# Altium schematic sheet MPBoard_L2_Relay1_ext.SchDoc
size A3; SheetNumber: 2; SheetTotal: 5
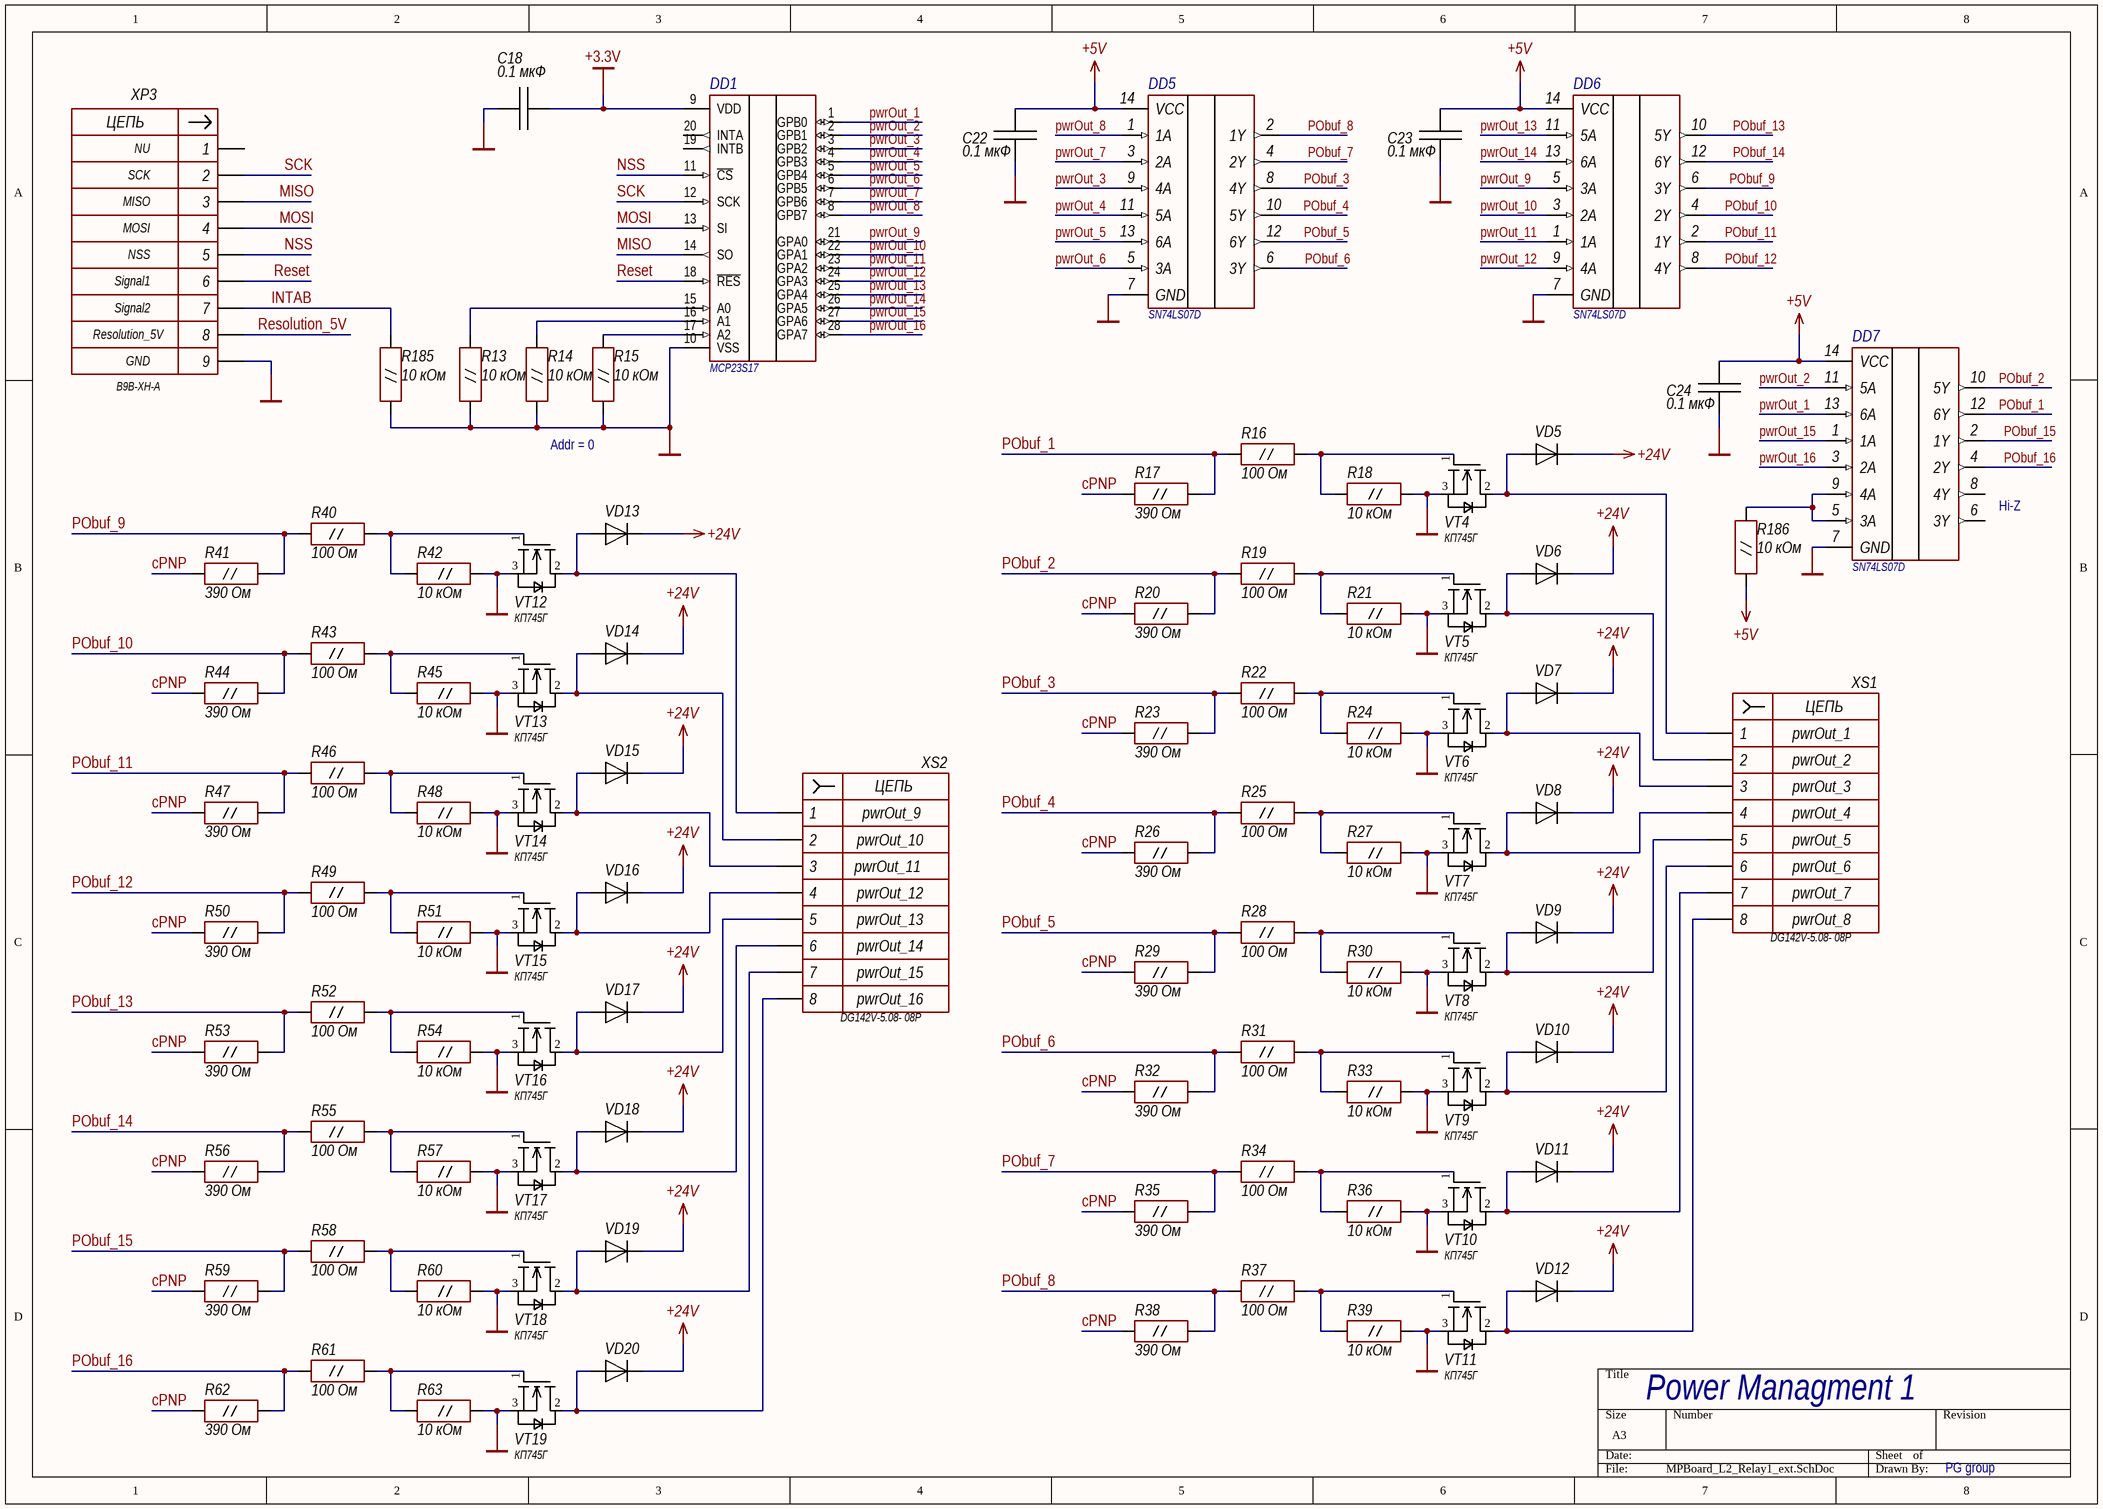
[diagram p0: MPBoard_L2_Relay1_ext.SchDoc]

## Parts
C18  0.1 мкФ  [CAP-0603]
C22  0.1 мкФ  [CAP-0603]
C23  0.1 мкФ  [CAP-0603]
C24  0.1 мкФ  [CAP-0603]
DD1  MCP23S17  [SOIC-28]
DD5  SN74LS07D  [SOIC-14]
DD6  SN74LS07D  [SOIC-14]
DD7  SN74LS07D  [SOIC-14]
R13  10 кОм  [RES-0603]
R14  10 кОм  [RES-0603]
R15  10 кОм  [RES-0603]
R16  100 Ом  [RES-0805]
R17  390 Ом  [RES-0805]
R18  10 кОм  [RES-0805]
R19  100 Ом  [RES-0805]
R20  390 Ом  [RES-0805]
R21  10 кОм  [RES-0805]
R22  100 Ом  [RES-0805]
R23  390 Ом  [RES-0805]
R24  10 кОм  [RES-0805]
R25  100 Ом  [RES-0805]
R26  390 Ом  [RES-0805]
R27  10 кОм  [RES-0805]
R28  100 Ом  [RES-0805]
R29  390 Ом  [RES-0805]
R30  10 кОм  [RES-0805]
R31  100 Ом  [RES-0805]
R32  390 Ом  [RES-0805]
R33  10 кОм  [RES-0805]
R34  100 Ом  [RES-0805]
R35  390 Ом  [RES-0805]
R36  10 кОм  [RES-0805]
R37  100 Ом  [RES-0805]
R38  390 Ом  [RES-0805]
R39  10 кОм  [RES-0805]
R40  100 Ом  [RES-0805]
R41  390 Ом  [RES-0805]
R42  10 кОм  [RES-0805]
R43  100 Ом  [RES-0805]
R44  390 Ом  [RES-0805]
R45  10 кОм  [RES-0805]
R46  100 Ом  [RES-0805]
R47  390 Ом  [RES-0805]
R48  10 кОм  [RES-0805]
R49  100 Ом  [RES-0805]
R50  390 Ом  [RES-0805]
R51  10 кОм  [RES-0805]
R52  100 Ом  [RES-0805]
R53  390 Ом  [RES-0805]
R54  10 кОм  [RES-0805]
R55  100 Ом  [RES-0805]
R56  390 Ом  [RES-0805]
R57  10 кОм  [RES-0805]
R58  100 Ом  [RES-0805]
R59  390 Ом  [RES-0805]
R60  10 кОм  [RES-0805]
R61  100 Ом  [RES-0805]
R62  390 Ом  [RES-0805]
R63  10 кОм  [RES-0805]
R185  10 кОм  [RES-0603]
R186  10 кОм  [RES-0603]
VD5  HER108  [DIOD-MILS-400]  (value not drawn)
VD6  HER108  [DIOD-MILS-400]  (value not drawn)
VD7  HER108  [DIOD-MILS-400]  (value not drawn)
VD8  HER108  [DIOD-MILS-400]  (value not drawn)
VD9  HER108  [DIOD-MILS-400]  (value not drawn)
VD10  HER108  [DIOD-MILS-400]  (value not drawn)
VD11  HER108  [DIOD-MILS-400]  (value not drawn)
VD12  HER108  [DIOD-MILS-400]  (value not drawn)
VD13  HER108  [DIOD-MILS-400]  (value not drawn)
VD14  HER108  [DIOD-MILS-400]  (value not drawn)
VD15  HER108  [DIOD-MILS-400]  (value not drawn)
VD16  HER108  [DIOD-MILS-400]  (value not drawn)
VD17  HER108  [DIOD-MILS-400]  (value not drawn)
VD18  HER108  [DIOD-MILS-400]  (value not drawn)
VD19  HER108  [DIOD-MILS-400]  (value not drawn)
VD20  HER108  [DIOD-MILS-400]  (value not drawn)
VT4  КП745Г  [TO220S inline]
VT5  КП745Г  [TO220S inline]
VT6  КП745Г  [TO220S inline]
VT7  КП745Г  [TO220S inline]
VT8  КП745Г  [TO220S inline]
VT9  КП745Г  [TO220S inline]
VT10  КП745Г  [TO220S inline]
VT11  КП745Г  [TO220S inline]
VT12  КП745Г  [TO220S inline]
VT13  КП745Г  [TO220S inline]
VT14  КП745Г  [TO220S inline]
VT15  КП745Г  [TO220S inline]
VT16  КП745Г  [TO220S inline]
VT17  КП745Г  [TO220S inline]
VT18  КП745Г  [TO220S inline]
VT19  КП745Г  [TO220S inline]
XP3  B9B-XH-A  NET9: GND  NET8: Resolution_5V  NET7: Signal2  NET6: Signal1  NET5: MOSI  NET1: NU  NET2: NSS  NET3: SCK  NET4: MISO  [JST-B9B-XH-A]
XS1  DG142V-5.08- 08P  NET6: pwrOut_6  NET5: pwrOut_5  NET1: pwrOut_1  NET2: pwrOut_2  NET3: pwrOut_3  NET4: pwrOut_4  NET7: pwrOut_7  NET8: pwrOut_8  [DG142V-5.08-08]
XS2  DG142V-5.08- 08P  NET6: pwrOut_14  NET5: pwrOut_13  NET1: pwrOut_9  NET2: pwrOut_10  NET3: pwrOut_11  NET4: pwrOut_12  NET7: pwrOut_15  NET8: pwrOut_16  [DG142V-5.08-08]

## Nets
+3.3V: C18.2 DD1.9(VDD)
+5V: C22.2 C23.2 C24.2 DD5.14(VCC) DD6.14(VCC) DD7.14(VCC) R186.1
+24V: VD5.2 VD6.2 VD7.2 VD8.2 VD9.2 VD10.2 VD11.2 VD12.2 VD13.2 VD14.2 VD15.2 VD16.2 VD17.2 VD18.2 VD19.2 VD20.2
GND: C18.1 C22.1 C23.1 C24.1 DD1.10(VSS) DD5.7(GND) DD6.7(GND) DD7.7(GND) R13.1 R14.1 R15.1 R18.1 R21.1 R24.1 R27.1 R30.1 R33.1 R36.1 R39.1 R42.1 R45.1 R48.1 R51.1 R54.1 R57.1 R60.1 R63.1 R185.1 VT4.3(S) VT5.3(S) VT6.3(S) VT7.3(S) VT8.3(S) VT9.3(S) VT10.3(S) VT11.3(S) VT12.3(S) VT13.3(S) VT14.3(S) VT15.3(S) VT16.3(S) VT17.3(S) VT18.3(S) VT19.3(S) XP3.9
cPNP: R17.1 R20.1 R23.1 R26.1 R29.1 R32.1 R35.1 R38.1 R41.1 R44.1 R47.1 R50.1 R53.1 R56.1 R59.1 R62.1
INTAB: R185.2 XP3.7
MISO: DD1.14(SO) XP3.3
MOSI: DD1.13(SI) XP3.4
NSS: DD1.11(~{CS}) XP3.5
PObuf_1: DD7.12(6Y) R16.1 R17.2
PObuf_2: DD7.10(5Y) R19.1 R20.2
PObuf_3: DD5.8(4Y) R22.1 R23.2
PObuf_4: DD5.10(5Y) R25.1 R26.2
PObuf_5: DD5.12(6Y) R28.1 R29.2
PObuf_6: DD5.6(3Y) R31.1 R32.2
PObuf_7: DD5.4(2Y) R34.1 R35.2
PObuf_8: DD5.2(1Y) R37.1 R38.2
PObuf_9: DD6.6(3Y) R40.1 R41.2
PObuf_10: DD6.4(2Y) R43.1 R44.2
PObuf_11: DD6.2(1Y) R46.1 R47.2
PObuf_12: DD6.8(4Y) R49.1 R50.2
PObuf_13: DD6.10(5Y) R52.1 R53.2
PObuf_14: DD6.12(6Y) R55.1 R56.2
PObuf_15: DD7.2(1Y) R58.1 R59.2
PObuf_16: DD7.4(2Y) R61.1 R62.2
pwrOut_1: DD1.1(GPB0) DD7.13(6A)
pwrOut_2: DD1.2(GPB1) DD7.11(5A)
pwrOut_3: DD1.3(GPB2) DD5.9(4A)
pwrOut_4: DD1.4(GPB3) DD5.11(5A)
pwrOut_5: DD1.5(GPB4) DD5.13(6A)
pwrOut_6: DD1.6(GPB5) DD5.5(3A)
pwrOut_7: DD1.7(GPB6) DD5.3(2A)
pwrOut_8: DD1.8(GPB7) DD5.1(1A)
pwrOut_9: DD1.21(GPA0) DD6.5(3A)
pwrOut_10: DD1.22(GPA1) DD6.3(2A)
pwrOut_11: DD1.23(GPA2) DD6.1(1A)
pwrOut_12: DD1.24(GPA3) DD6.9(4A)
pwrOut_13: DD1.25(GPA4) DD6.11(5A)
pwrOut_14: DD1.26(GPA5) DD6.13(6A)
pwrOut_15: DD1.27(GPA6) DD7.1(1A)
pwrOut_16: DD1.28(GPA7) DD7.3(2A)
Reset: DD1.18(~{RES}) XP3.6
Resolution_5V: XP3.8
SCK: DD1.12(SCK) XP3.2
NetDD1_15: DD1.15(A0) R13.2
NetDD1_16: DD1.16(A1) R14.2
NetDD1_17: DD1.17(A2) R15.2
NetDD7_5: DD7.5(3A) DD7.9(4A) R186.2
NetR16_2: R16.2 R18.2 VT4.1(G)
NetR19_2: R19.2 R21.2 VT5.1(G)
NetR22_2: R22.2 R24.2 VT6.1(G)
NetR25_2: R25.2 R27.2 VT7.1(G)
NetR28_2: R28.2 R30.2 VT8.1(G)
NetR31_2: R31.2 R33.2 VT9.1(G)
NetR34_2: R34.2 R36.2 VT10.1(G)
NetR37_2: R37.2 R39.2 VT11.1(G)
NetR40_2: R40.2 R42.2 VT12.1(G)
NetR43_2: R43.2 R45.2 VT13.1(G)
NetR46_2: R46.2 R48.2 VT14.1(G)
NetR49_2: R49.2 R51.2 VT15.1(G)
NetR52_2: R52.2 R54.2 VT16.1(G)
NetR55_2: R55.2 R57.2 VT17.1(G)
NetR58_2: R58.2 R60.2 VT18.1(G)
NetR61_2: R61.2 R63.2 VT19.1(G)
NetVD5_1: VD5.1 VT4.2(D) XS1.1
NetVD6_1: VD6.1 VT5.2(D) XS1.2
NetVD7_1: VD7.1 VT6.2(D) XS1.3
NetVD8_1: VD8.1 VT7.2(D) XS1.4
NetVD9_1: VD9.1 VT8.2(D) XS1.5
NetVD10_1: VD10.1 VT9.2(D) XS1.6
NetVD11_1: VD11.1 VT10.2(D) XS1.7
NetVD12_1: VD12.1 VT11.2(D) XS1.8
NetVD13_1: VD13.1 VT12.2(D) XS2.1
NetVD14_1: VD14.1 VT13.2(D) XS2.2
NetVD15_1: VD15.1 VT14.2(D) XS2.3
NetVD16_1: VD16.1 VT15.2(D) XS2.4
NetVD17_1: VD17.1 VT16.2(D) XS2.5
NetVD18_1: VD18.1 VT17.2(D) XS2.6
NetVD19_1: VD19.1 VT18.2(D) XS2.7
NetVD20_1: VD20.1 VT19.2(D) XS2.8

Not connected (* = marked no-connect by the designer): DD1 19(INTB) 20(INTA); DD7 6(3Y) 8(4Y); XP3 1

## Notes on the sheet
- Addr = 0
- (near DD7) Hi-Z
- Power Managment 1
- PG group
- (in symbol XP9) ЦЕПЬ
- (in symbol XS8) ЦЕПЬ

## Library data of the parts
C18 C22-C24 = C: Конденсатор; MFPartNum: C0603C101K5GAC; IPSPartNumber: 65-724-19; Dielectric: X7R; MF: KEMET; Tolerance: ± 10 %; Voltage: 50 В; ValueDescription: Конденсатор 0.1 мкФ ± 10 % 50 В X7R SMD 0603; Package: SMD 0603; Value: 0.1 мкФ; HelpURL: https://content.kemet.com/datasheets/KEM_C1002_X7R_SMD.pdf; NameRUS: Конденсатор
DD1 = DD_MCP23S17: I/O Expander 16 SPI; MF: Microchip; MFPartNum: MCP23S17; Package: SOIC-28; HelpURL: https://www.chipdip.ru/product/mcp23s17-e-so
DD5-DD7 = DD_SN74LS07D: 6-ch, 4.75_5.25V bipolar buffers with OC outputs; MF: Texas Instruments; MFPartNum: SN74LS07D; Package: SOIC-14; HelpURL: https://www.chipdip.by/product/sn74ls07d
R13-R15 R185 R186 = R_0.125W: Резистор 0.1 W; MFPartNum: D11/CRCW0603; MF: Vishay; Tolerance: ± 1 %; ValueDescription: Резистор 10 кОм ± 1 % SMD 0603; Package: SMD 0603; Value: 10 кОм; HelpURL: https://www.vishay.com/docs/20035/dcrcwe3.pdf; IPSPartNumber: *; NameRUS: Резистор
R16 R19 R22 R25 R28 R31 R34 R37 R40 R43 R46 R49 R52 R55 R58 R61 = R_0.125W: Резистор 0.125 W; MFPartNum: CRCW080513K3FKEA; MF: Vishay; Tolerance: ± 1 %; ValueDescription: Резистор 100 Ом ± 1 % SMD 0805; Package: SMD 0805; Value: 100 Ом; HelpURL: https://www.vishay.com/docs/20035/dcrcwe3.pdf; IPSPartNumber: *; NameRUS: Резистор
R17 R20 R23 R26 R29 R32 R35 R38 R41 R44 R47 R50 R53 R56 R59 R62 = R_0.125W: Резистор 0.125 W; MFPartNum: CRCW080513K3FKEA; MF: Vishay; Tolerance: ± 1 %; ValueDescription: Резистор 390 Ом ± 1 % SMD 0805; Package: SMD 0805; Value: 390 Ом; HelpURL: https://www.vishay.com/docs/20035/dcrcwe3.pdf; IPSPartNumber: *; NameRUS: Резистор
R18 R21 R24 R27 R30 R33 R36 R39 R42 R45 R48 R51 R54 R57 R60 R63 = R_0.125W: Резистор 0.125 W; MFPartNum: CRCW080513K3FKEA; MF: Vishay; Tolerance: ± 1 %; ValueDescription: Резистор 10 кОм ± 1 % SMD 0805; Package: SMD 0805; Value: 10 кОм; HelpURL: https://www.vishay.com/docs/20035/dcrcwe3.pdf; IPSPartNumber: *; NameRUS: Резистор
VD5-VD20 = VD: Диод Выпрямительный; MFPartNum: HER108G; MF: Taiwan Semiconductor; ValueDescription: Диод выпрямительный HER108 DO-204AL-2; HelpURL: https://eu.mouser.com/ProductDetail/?qs=tHU%2FlV7kTySN6KO41tibrA%3D%3D; Value: HER108; Package: DO-204AL-2; NameRUS: Диод выпрямительный
VT4-VT19 = VT_N-MOSFET: MOSFET; MF: Интеграл; Voltage: 100 В; Current: 15 А; Analogue: IRL530N; MFPartNum: КП745Г; Package: TO-220; HelpURL: https://belchip.by/product/?selected_product=10167
XP3 = XP9: вилка 9 контактов; MF: JST Corporation; Analogue: CWF-9; WK-09; DS1069-9MVW6; CWF-9 W7600-09PSNTW0R; ValueDescription: Разъем вилка B9B-XH-A; NameRUS: Разъем вилка; MFPartNum: B9B-XH-A; HelpURL: https://www.chipdip.ru/product0/8007237297?from=suggest_product; Value: B9B-XH-A
XS1 XS2 = XS8: розетка 8 контактов; MFPartNum: DG142V-5.08- 08P-14-00A(H); MF: Degson Electronics; ValueDescription: Разъем розетка DG142V-5.08- 08P; NameRUS: Разъем розетка; Value: DG142V-5.08- 08P; HelpURL: https://www.chipdip.by/product0/8077186472; IPSPartNumber: *